# EAGLE board automatrix (EAGLE 9.3.2), part 1 of 3
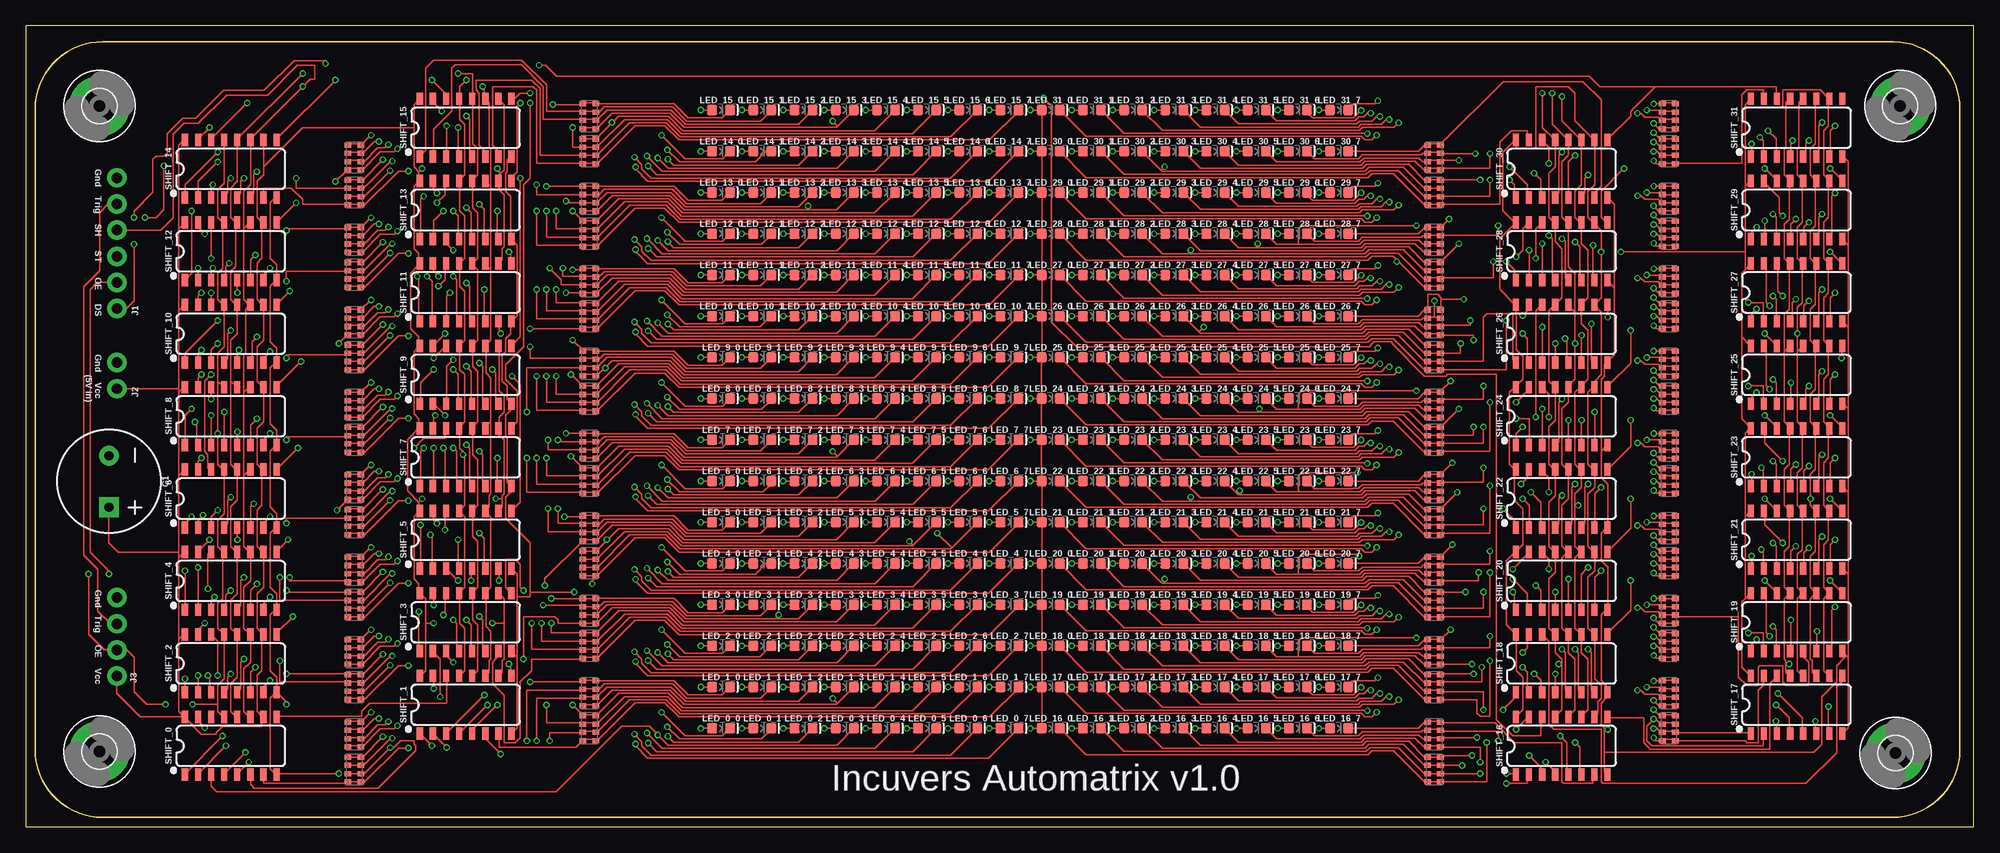
[diagram p5: board, top side]
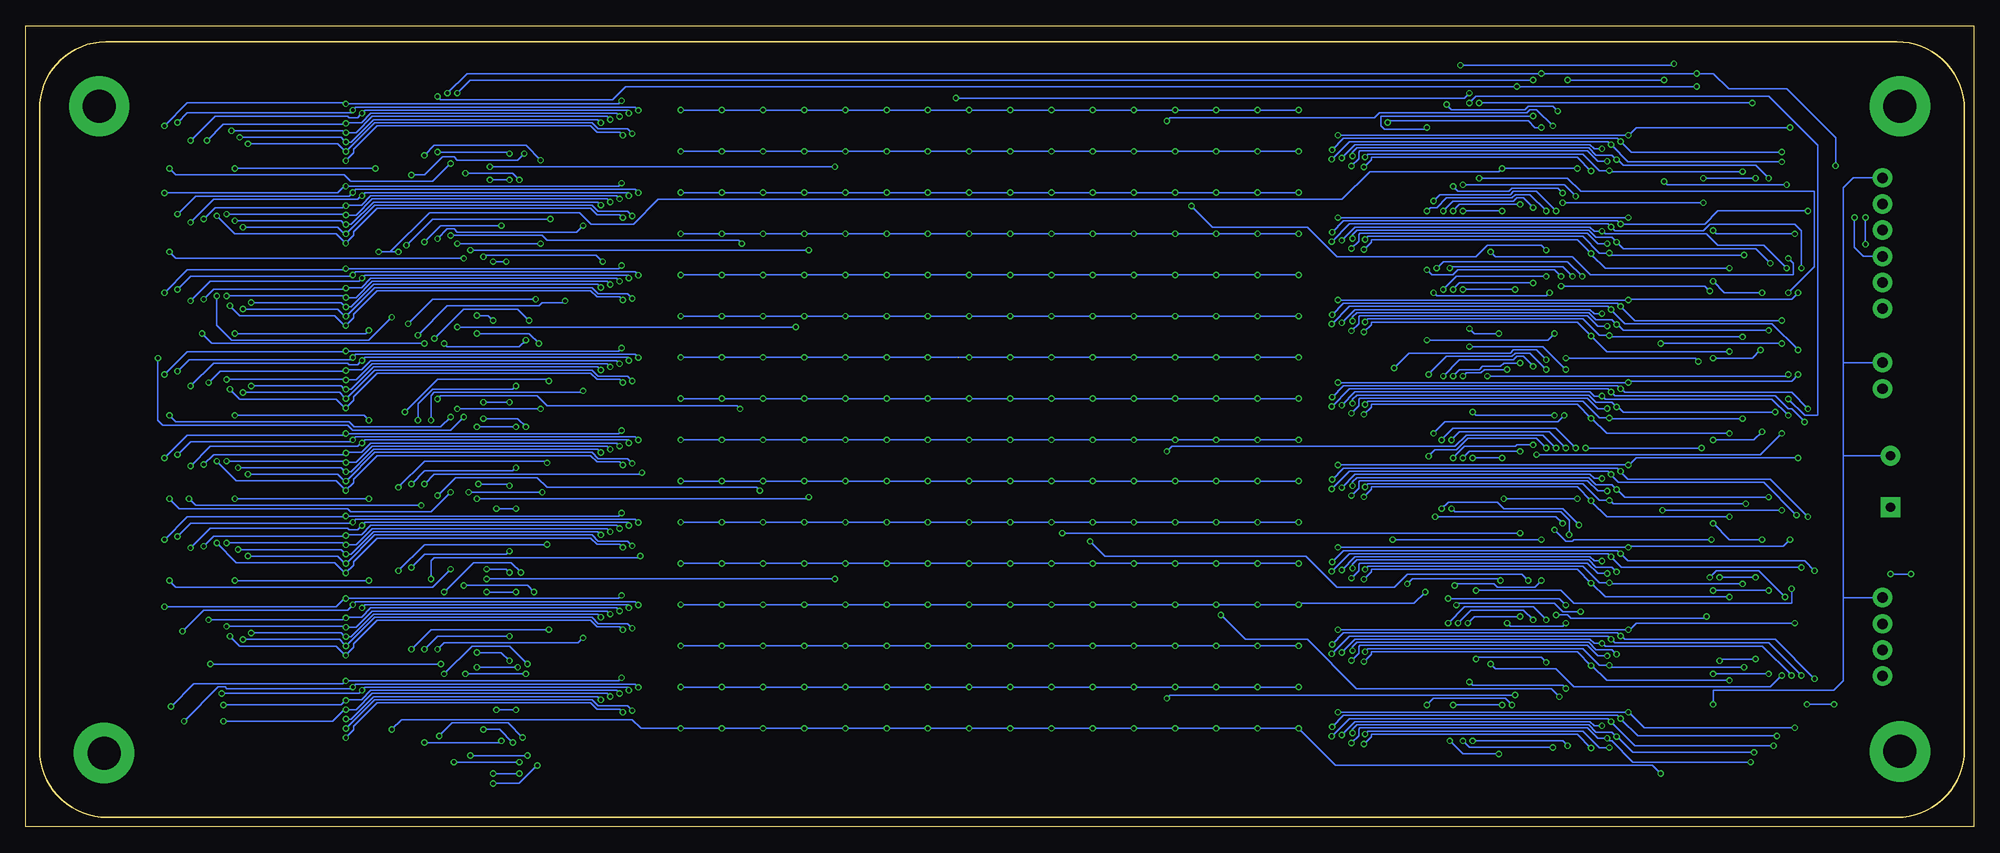
[diagram p6: board, bottom side, seen from below]

Size 189.11 x 77.75 mm. Coordinates in mm from the lower left corner, seen from the top.
Outline: 0,0 189.11,0 189.11,77.75 0,77.75 0,0
Outline: 7.47,76.2 arc90 0.91,69.65 0.91,7.47 arc90 7.47,0.91 181.2,0.91 arc90 187.76,7.47 187.76,69.65 arc90 181.36,76.2 7.47,76.2
Copper layers (1*16): Top 0.035559375mm / dielectric 1.6mm / Bottom 0.035559375mm
Design rules "oshpark-2layer": minimum track width 6mil, minimum drill 10mil, track to track 6mil, track to pad 6mil, pad to pad 6mil, via to via 6mil, smd to smd 6mil, copper to edge 15mil, drill to drill 6mil, minimum pad ring 5mil, minimum via ring 5mil, stop-mask expansion 2.5mil, vias tented up to drill 0mil, thermal gap 10mil
Net classes: 0 default: width 0.152 mm, drill 0.152 mm, clearance 0.152 mm

## Footprints (pad centres in the part's own frame; a part is rotated, then mirrored left to right if it is on the bottom)
0603-ARC = smd 0.5 x 0.65: 1 -1.2,-0.625; 2 -0.4,-0.625; 3 0.4,-0.625; 4 1.2,-0.625; 5 1.2,0.625; 6 0.4,0.625; 7 -0.4,0.625; 8 -1.2,0.625
CPOL-RADIAL-5MM-10MM = drill 0.9 pad 1.93 square: + 2.5,0 | drill 0.9 pad 1.93: - -2.5,0
3,2-PAD = drill 3.2 pad 5.842: B3,2 0,0
1X06_NO_SILK = drill 1.016 pad 1.88: 1 0,0; 2 2.54,0; 3 5.08,0; 4 7.62,0; 5 10.16,0; 6 12.7,0
1X02_NO_SILK = drill 1.016 pad 1.88: 1 0,0; 2 2.54,0
1X04_NO_SILK = drill 1.016 pad 1.88: 1 0,0; 2 2.54,0; 3 5.08,0; 4 7.62,0
LED-0603 = smd 1 x 1: A -0.877,0; C 0.877,0
SO16 = smd 0.6 x 1.2: 1 -4.445,-2.8; 2 -3.175,-2.8; 3 -1.905,-2.8; 4 -0.635,-2.8; 5 0.635,-2.8; 6 1.905,-2.8; 7 3.175,-2.8; 8 4.445,-2.8; 9 4.445,2.8; 10 3.175,2.8; 11 1.905,2.8; 12 0.635,2.8; 13 -0.635,2.8; 14 -1.905,2.8; 15 -3.175,2.8; 16 -4.445,2.8

## Placement (x,y rotation side)
4R_0_0  [0603-ARC]  31.91,8.97 270 top
4R_0_1  [0603-ARC]  31.91,5.57 270 top
4R_1_0  [0603-ARC]  54.71,12.97 270 top
4R_1_1  [0603-ARC]  54.71,9.57 270 top
4R_2_0  [0603-ARC]  31.91,16.97 270 top
4R_2_1  [0603-ARC]  31.91,13.57 270 top
4R_3_0  [0603-ARC]  54.71,20.97 270 top
4R_3_1  [0603-ARC]  54.71,17.57 270 top
4R_4_0  [0603-ARC]  31.91,24.97 270 top
4R_4_1  [0603-ARC]  31.91,21.57 270 top
4R_5_0  [0603-ARC]  54.71,28.97 270 top
4R_5_1  [0603-ARC]  54.71,25.57 270 top
4R_6_0  [0603-ARC]  31.91,32.97 270 top
4R_6_1  [0603-ARC]  31.91,29.57 270 top
4R_7_0  [0603-ARC]  54.71,36.97 270 top
4R_7_1  [0603-ARC]  54.71,33.57 270 top
4R_8_0  [0603-ARC]  31.91,40.97 270 top
4R_8_1  [0603-ARC]  31.91,37.57 270 top
4R_9_0  [0603-ARC]  54.71,44.97 270 top
4R_9_1  [0603-ARC]  54.71,41.57 270 top
4R_10_0  [0603-ARC]  31.91,48.97 270 top
4R_10_1  [0603-ARC]  31.91,45.57 270 top
4R_11_0  [0603-ARC]  54.71,52.97 270 top
4R_11_1  [0603-ARC]  54.71,49.57 270 top
4R_12_0  [0603-ARC]  31.91,56.97 270 top
4R_12_1  [0603-ARC]  31.91,53.57 270 top
4R_13_0  [0603-ARC]  54.71,60.97 270 top
4R_13_1  [0603-ARC]  54.71,57.57 270 top
4R_14_0  [0603-ARC]  31.91,64.97 270 top
4R_14_1  [0603-ARC]  31.91,61.57 270 top
4R_15_0  [0603-ARC]  54.71,68.97 270 top
4R_15_1  [0603-ARC]  54.71,65.57 270 top
4R_16_0  [0603-ARC]  136.71,5.57 90 top
4R_16_1  [0603-ARC]  136.71,8.97 90 top
4R_17_0  [0603-ARC]  159.51,9.57 90 top
4R_17_1  [0603-ARC]  159.51,12.97 90 top
4R_18_0  [0603-ARC]  136.71,13.57 90 top
4R_18_1  [0603-ARC]  136.71,16.97 90 top
4R_19_0  [0603-ARC]  159.51,17.57 90 top
4R_19_1  [0603-ARC]  159.51,20.97 90 top
4R_20_0  [0603-ARC]  136.71,21.57 90 top
4R_20_1  [0603-ARC]  136.71,24.97 90 top
4R_21_0  [0603-ARC]  159.51,25.57 90 top
4R_21_1  [0603-ARC]  159.51,28.97 90 top
4R_22_0  [0603-ARC]  136.71,29.57 90 top
4R_22_1  [0603-ARC]  136.71,32.97 90 top
4R_23_0  [0603-ARC]  159.51,33.57 90 top
4R_23_1  [0603-ARC]  159.51,36.97 90 top
4R_24_0  [0603-ARC]  136.71,37.57 90 top
4R_24_1  [0603-ARC]  136.71,40.97 90 top
4R_25_0  [0603-ARC]  159.51,41.57 90 top
4R_25_1  [0603-ARC]  159.51,44.97 90 top
4R_26_0  [0603-ARC]  136.71,45.57 90 top
4R_26_1  [0603-ARC]  136.71,48.97 90 top
4R_27_0  [0603-ARC]  159.51,49.57 90 top
4R_27_1  [0603-ARC]  159.51,52.97 90 top
4R_28_0  [0603-ARC]  136.71,53.57 90 top
4R_28_1  [0603-ARC]  136.71,56.97 90 top
4R_29_0  [0603-ARC]  159.51,57.57 90 top
4R_29_1  [0603-ARC]  159.51,60.97 90 top
4R_30_0  [0603-ARC]  136.71,61.57 90 top
4R_30_1  [0603-ARC]  136.71,64.97 90 top
4R_31_0  [0603-ARC]  159.51,65.57 90 top
4R_31_1  [0603-ARC]  159.51,68.97 90 top
C1  470 uF  [CPOL-RADIAL-5MM-10MM]  8.08,33.53 270 top
H1  MOUNT-PAD-ROUND3.2  [3,2-PAD]  7.16,69.95 0 top
H2  MOUNT-PAD-ROUND3.2  [3,2-PAD]  181.97,69.95 0 top
H3  MOUNT-PAD-ROUND3.2  [3,2-PAD]  7.16,7.32 0 top
H4  MOUNT-PAD-ROUND3.2  [3,2-PAD]  181.51,7.16 0 top
J1  [1X06_NO_SILK]  8.84,50.29 90 top
J2  [1X02_NO_SILK]  8.84,42.52 90 top
J3  [1X04_NO_SILK]  8.84,14.63 90 top
LED_0_0  GREEN  [LED-0603]  67.51,9.57 0 top
LED_0_1  GREEN  [LED-0603]  71.51,9.57 0 top
LED_0_2  GREEN  [LED-0603]  75.51,9.57 0 top
LED_0_3  GREEN  [LED-0603]  79.51,9.57 0 top
LED_0_4  GREEN  [LED-0603]  83.51,9.57 0 top
LED_0_5  GREEN  [LED-0603]  87.51,9.57 0 top
LED_0_6  GREEN  [LED-0603]  91.51,9.57 0 top
LED_0_7  GREEN  [LED-0603]  95.51,9.57 0 top
LED_1_0  GREEN  [LED-0603]  67.51,13.57 0 top
LED_1_1  GREEN  [LED-0603]  71.51,13.57 0 top
LED_1_2  GREEN  [LED-0603]  75.51,13.57 0 top
LED_1_3  GREEN  [LED-0603]  79.51,13.57 0 top
LED_1_4  GREEN  [LED-0603]  83.51,13.57 0 top
LED_1_5  GREEN  [LED-0603]  87.51,13.57 0 top
LED_1_6  GREEN  [LED-0603]  91.51,13.57 0 top
LED_1_7  GREEN  [LED-0603]  95.51,13.57 0 top
LED_2_0  GREEN  [LED-0603]  67.51,17.57 0 top
LED_2_1  GREEN  [LED-0603]  71.51,17.57 0 top
LED_2_2  GREEN  [LED-0603]  75.51,17.57 0 top
LED_2_3  GREEN  [LED-0603]  79.51,17.57 0 top
LED_2_4  GREEN  [LED-0603]  83.51,17.57 0 top
LED_2_5  GREEN  [LED-0603]  87.51,17.57 0 top
LED_2_6  GREEN  [LED-0603]  91.51,17.57 0 top
LED_2_7  GREEN  [LED-0603]  95.51,17.57 0 top
LED_3_0  GREEN  [LED-0603]  67.51,21.57 0 top
LED_3_1  GREEN  [LED-0603]  71.51,21.57 0 top
LED_3_2  GREEN  [LED-0603]  75.51,21.57 0 top
LED_3_3  GREEN  [LED-0603]  79.51,21.57 0 top
LED_3_4  GREEN  [LED-0603]  83.51,21.57 0 top
LED_3_5  GREEN  [LED-0603]  87.51,21.57 0 top
LED_3_6  GREEN  [LED-0603]  91.51,21.57 0 top
LED_3_7  GREEN  [LED-0603]  95.51,21.57 0 top
LED_4_0  GREEN  [LED-0603]  67.51,25.57 0 top
LED_4_1  GREEN  [LED-0603]  71.51,25.57 0 top
LED_4_2  GREEN  [LED-0603]  75.51,25.57 0 top
LED_4_3  GREEN  [LED-0603]  79.51,25.57 0 top
LED_4_4  GREEN  [LED-0603]  83.51,25.57 0 top
LED_4_5  GREEN  [LED-0603]  87.51,25.57 0 top
LED_4_6  GREEN  [LED-0603]  91.51,25.57 0 top
LED_4_7  GREEN  [LED-0603]  95.51,25.57 0 top
LED_5_0  GREEN  [LED-0603]  67.51,29.57 0 top
LED_5_1  GREEN  [LED-0603]  71.51,29.57 0 top
LED_5_2  GREEN  [LED-0603]  75.51,29.57 0 top
LED_5_3  GREEN  [LED-0603]  79.51,29.57 0 top
LED_5_4  GREEN  [LED-0603]  83.51,29.57 0 top
LED_5_5  GREEN  [LED-0603]  87.51,29.57 0 top
LED_5_6  GREEN  [LED-0603]  91.51,29.57 0 top
LED_5_7  GREEN  [LED-0603]  95.51,29.57 0 top
LED_6_0  GREEN  [LED-0603]  67.51,33.57 0 top
LED_6_1  GREEN  [LED-0603]  71.51,33.57 0 top
LED_6_2  GREEN  [LED-0603]  75.51,33.57 0 top
LED_6_3  GREEN  [LED-0603]  79.51,33.57 0 top
LED_6_4  GREEN  [LED-0603]  83.51,33.57 0 top
LED_6_5  GREEN  [LED-0603]  87.51,33.57 0 top
LED_6_6  GREEN  [LED-0603]  91.51,33.57 0 top
LED_6_7  GREEN  [LED-0603]  95.51,33.57 0 top
LED_7_0  GREEN  [LED-0603]  67.51,37.57 0 top
LED_7_1  GREEN  [LED-0603]  71.51,37.57 0 top
LED_7_2  GREEN  [LED-0603]  75.51,37.57 0 top
LED_7_3  GREEN  [LED-0603]  79.51,37.57 0 top
LED_7_4  GREEN  [LED-0603]  83.51,37.57 0 top
LED_7_5  GREEN  [LED-0603]  87.51,37.57 0 top
LED_7_6  GREEN  [LED-0603]  91.51,37.57 0 top
LED_7_7  GREEN  [LED-0603]  95.51,37.57 0 top
LED_8_0  GREEN  [LED-0603]  67.51,41.57 0 top
LED_8_1  GREEN  [LED-0603]  71.51,41.57 0 top
LED_8_2  GREEN  [LED-0603]  75.51,41.57 0 top
LED_8_3  GREEN  [LED-0603]  79.51,41.57 0 top
LED_8_4  GREEN  [LED-0603]  83.51,41.57 0 top
LED_8_5  GREEN  [LED-0603]  87.51,41.57 0 top
LED_8_6  GREEN  [LED-0603]  91.51,41.57 0 top
LED_8_7  GREEN  [LED-0603]  95.51,41.57 0 top
LED_9_0  GREEN  [LED-0603]  67.51,45.57 0 top
LED_9_1  GREEN  [LED-0603]  71.51,45.57 0 top
LED_9_2  GREEN  [LED-0603]  75.51,45.57 0 top
LED_9_3  GREEN  [LED-0603]  79.51,45.57 0 top
LED_9_4  GREEN  [LED-0603]  83.51,45.57 0 top
LED_9_5  GREEN  [LED-0603]  87.51,45.57 0 top
LED_9_6  GREEN  [LED-0603]  91.51,45.57 0 top
LED_9_7  GREEN  [LED-0603]  95.51,45.57 0 top
LED_10_0  GREEN  [LED-0603]  67.51,49.57 0 top
LED_10_1  GREEN  [LED-0603]  71.51,49.57 0 top
LED_10_2  GREEN  [LED-0603]  75.51,49.57 0 top
LED_10_3  GREEN  [LED-0603]  79.51,49.57 0 top
LED_10_4  GREEN  [LED-0603]  83.51,49.57 0 top
LED_10_5  GREEN  [LED-0603]  87.51,49.57 0 top
LED_10_6  GREEN  [LED-0603]  91.51,49.57 0 top
LED_10_7  GREEN  [LED-0603]  95.51,49.57 0 top
LED_11_0  GREEN  [LED-0603]  67.51,53.57 0 top
LED_11_1  GREEN  [LED-0603]  71.51,53.57 0 top
LED_11_2  GREEN  [LED-0603]  75.51,53.57 0 top
LED_11_3  GREEN  [LED-0603]  79.51,53.57 0 top
LED_11_4  GREEN  [LED-0603]  83.51,53.57 0 top
LED_11_5  GREEN  [LED-0603]  87.51,53.57 0 top
LED_11_6  GREEN  [LED-0603]  91.51,53.57 0 top
LED_11_7  GREEN  [LED-0603]  95.51,53.57 0 top
LED_12_0  GREEN  [LED-0603]  67.51,57.57 0 top
LED_12_1  GREEN  [LED-0603]  71.51,57.57 0 top
LED_12_2  GREEN  [LED-0603]  75.51,57.57 0 top
LED_12_3  GREEN  [LED-0603]  79.51,57.57 0 top
LED_12_4  GREEN  [LED-0603]  83.51,57.57 0 top
LED_12_5  GREEN  [LED-0603]  87.51,57.57 0 top
LED_12_6  GREEN  [LED-0603]  91.51,57.57 0 top
LED_12_7  GREEN  [LED-0603]  95.51,57.57 0 top
LED_13_0  GREEN  [LED-0603]  67.51,61.57 0 top
LED_13_1  GREEN  [LED-0603]  71.51,61.57 0 top
LED_13_2  GREEN  [LED-0603]  75.51,61.57 0 top
LED_13_3  GREEN  [LED-0603]  79.51,61.57 0 top
LED_13_4  GREEN  [LED-0603]  83.51,61.57 0 top
LED_13_5  GREEN  [LED-0603]  87.51,61.57 0 top
LED_13_6  GREEN  [LED-0603]  91.51,61.57 0 top
LED_13_7  GREEN  [LED-0603]  95.51,61.57 0 top
LED_14_0  GREEN  [LED-0603]  67.51,65.57 0 top
LED_14_1  GREEN  [LED-0603]  71.51,65.57 0 top
LED_14_2  GREEN  [LED-0603]  75.51,65.57 0 top
LED_14_3  GREEN  [LED-0603]  79.51,65.57 0 top
LED_14_4  GREEN  [LED-0603]  83.51,65.57 0 top
LED_14_5  GREEN  [LED-0603]  87.51,65.57 0 top
LED_14_6  GREEN  [LED-0603]  91.51,65.57 0 top
LED_14_7  GREEN  [LED-0603]  95.51,65.57 0 top
LED_15_0  GREEN  [LED-0603]  67.51,69.57 0 top
LED_15_1  GREEN  [LED-0603]  71.51,69.57 0 top
LED_15_2  GREEN  [LED-0603]  75.51,69.57 0 top
LED_15_3  GREEN  [LED-0603]  79.51,69.57 0 top
LED_15_4  GREEN  [LED-0603]  83.51,69.57 0 top
LED_15_5  GREEN  [LED-0603]  87.51,69.57 0 top
LED_15_6  GREEN  [LED-0603]  91.51,69.57 0 top
LED_15_7  GREEN  [LED-0603]  95.51,69.57 0 top
LED_16_0  GREEN  [LED-0603]  99.51,9.57 0 top
LED_16_1  GREEN  [LED-0603]  103.51,9.57 0 top
LED_16_2  GREEN  [LED-0603]  107.51,9.57 0 top
LED_16_3  GREEN  [LED-0603]  111.51,9.57 0 top
LED_16_4  GREEN  [LED-0603]  115.51,9.57 0 top
LED_16_5  GREEN  [LED-0603]  119.51,9.57 0 top
LED_16_6  GREEN  [LED-0603]  123.51,9.57 0 top
LED_16_7  GREEN  [LED-0603]  127.51,9.57 0 top
LED_17_0  GREEN  [LED-0603]  99.51,13.57 0 top
LED_17_1  GREEN  [LED-0603]  103.51,13.57 0 top
LED_17_2  GREEN  [LED-0603]  107.51,13.57 0 top
LED_17_3  GREEN  [LED-0603]  111.51,13.57 0 top
LED_17_4  GREEN  [LED-0603]  115.51,13.57 0 top
LED_17_5  GREEN  [LED-0603]  119.51,13.57 0 top
LED_17_6  GREEN  [LED-0603]  123.51,13.57 0 top
LED_17_7  GREEN  [LED-0603]  127.51,13.57 0 top
LED_18_0  GREEN  [LED-0603]  99.51,17.57 0 top
LED_18_1  GREEN  [LED-0603]  103.51,17.57 0 top
LED_18_2  GREEN  [LED-0603]  107.51,17.57 0 top
LED_18_3  GREEN  [LED-0603]  111.51,17.57 0 top
LED_18_4  GREEN  [LED-0603]  115.51,17.57 0 top
LED_18_5  GREEN  [LED-0603]  119.51,17.57 0 top
LED_18_6  GREEN  [LED-0603]  123.51,17.57 0 top
LED_18_7  GREEN  [LED-0603]  127.51,17.57 0 top
LED_19_0  GREEN  [LED-0603]  99.51,21.57 0 top
LED_19_1  GREEN  [LED-0603]  103.51,21.57 0 top
LED_19_2  GREEN  [LED-0603]  107.51,21.57 0 top
LED_19_3  GREEN  [LED-0603]  111.51,21.57 0 top
LED_19_4  GREEN  [LED-0603]  115.51,21.57 0 top
LED_19_5  GREEN  [LED-0603]  119.51,21.57 0 top
LED_19_6  GREEN  [LED-0603]  123.51,21.57 0 top
LED_19_7  GREEN  [LED-0603]  127.51,21.57 0 top
LED_20_0  GREEN  [LED-0603]  99.51,25.57 0 top
LED_20_1  GREEN  [LED-0603]  103.51,25.57 0 top
LED_20_2  GREEN  [LED-0603]  107.51,25.57 0 top
LED_20_3  GREEN  [LED-0603]  111.51,25.57 0 top
LED_20_4  GREEN  [LED-0603]  115.51,25.57 0 top
LED_20_5  GREEN  [LED-0603]  119.51,25.57 0 top
LED_20_6  GREEN  [LED-0603]  123.51,25.57 0 top
LED_20_7  GREEN  [LED-0603]  127.51,25.57 0 top
LED_21_0  GREEN  [LED-0603]  99.51,29.57 0 top
LED_21_1  GREEN  [LED-0603]  103.51,29.57 0 top
LED_21_2  GREEN  [LED-0603]  107.51,29.57 0 top
LED_21_3  GREEN  [LED-0603]  111.51,29.57 0 top
LED_21_4  GREEN  [LED-0603]  115.51,29.57 0 top
LED_21_5  GREEN  [LED-0603]  119.51,29.57 0 top
LED_21_6  GREEN  [LED-0603]  123.51,29.57 0 top
LED_21_7  GREEN  [LED-0603]  127.51,29.57 0 top
LED_22_0  GREEN  [LED-0603]  99.51,33.57 0 top
LED_22_1  GREEN  [LED-0603]  103.51,33.57 0 top
LED_22_2  GREEN  [LED-0603]  107.51,33.57 0 top
LED_22_3  GREEN  [LED-0603]  111.51,33.57 0 top
LED_22_4  GREEN  [LED-0603]  115.51,33.57 0 top
LED_22_5  GREEN  [LED-0603]  119.51,33.57 0 top
LED_22_6  GREEN  [LED-0603]  123.51,33.57 0 top
LED_22_7  GREEN  [LED-0603]  127.51,33.57 0 top
LED_23_0  GREEN  [LED-0603]  99.51,37.57 0 top
LED_23_1  GREEN  [LED-0603]  103.51,37.57 0 top
LED_23_2  GREEN  [LED-0603]  107.51,37.57 0 top
LED_23_3  GREEN  [LED-0603]  111.51,37.57 0 top
LED_23_4  GREEN  [LED-0603]  115.51,37.57 0 top
LED_23_5  GREEN  [LED-0603]  119.51,37.57 0 top
LED_23_6  GREEN  [LED-0603]  123.51,37.57 0 top
LED_23_7  GREEN  [LED-0603]  127.51,37.57 0 top
LED_24_0  GREEN  [LED-0603]  99.51,41.57 0 top
LED_24_1  GREEN  [LED-0603]  103.51,41.57 0 top
LED_24_2  GREEN  [LED-0603]  107.51,41.57 0 top
LED_24_3  GREEN  [LED-0603]  111.51,41.57 0 top
LED_24_4  GREEN  [LED-0603]  115.51,41.57 0 top
LED_24_5  GREEN  [LED-0603]  119.51,41.57 0 top
LED_24_6  GREEN  [LED-0603]  123.51,41.57 0 top
LED_24_7  GREEN  [LED-0603]  127.51,41.57 0 top
LED_25_0  GREEN  [LED-0603]  99.51,45.57 0 top
LED_25_1  GREEN  [LED-0603]  103.51,45.57 0 top
LED_25_2  GREEN  [LED-0603]  107.51,45.57 0 top
LED_25_3  GREEN  [LED-0603]  111.51,45.57 0 top
LED_25_4  GREEN  [LED-0603]  115.51,45.57 0 top
LED_25_5  GREEN  [LED-0603]  119.51,45.57 0 top
LED_25_6  GREEN  [LED-0603]  123.51,45.57 0 top
LED_25_7  GREEN  [LED-0603]  127.51,45.57 0 top
LED_26_0  GREEN  [LED-0603]  99.51,49.57 0 top
LED_26_1  GREEN  [LED-0603]  103.51,49.57 0 top
LED_26_2  GREEN  [LED-0603]  107.51,49.57 0 top
LED_26_3  GREEN  [LED-0603]  111.51,49.57 0 top
LED_26_4  GREEN  [LED-0603]  115.51,49.57 0 top
LED_26_5  GREEN  [LED-0603]  119.51,49.57 0 top
LED_26_6  GREEN  [LED-0603]  123.51,49.57 0 top
LED_26_7  GREEN  [LED-0603]  127.51,49.57 0 top
LED_27_0  GREEN  [LED-0603]  99.51,53.57 0 top
LED_27_1  GREEN  [LED-0603]  103.51,53.57 0 top
LED_27_2  GREEN  [LED-0603]  107.51,53.57 0 top
LED_27_3  GREEN  [LED-0603]  111.51,53.57 0 top
LED_27_4  GREEN  [LED-0603]  115.51,53.57 0 top
LED_27_5  GREEN  [LED-0603]  119.51,53.57 0 top
LED_27_6  GREEN  [LED-0603]  123.51,53.57 0 top
LED_27_7  GREEN  [LED-0603]  127.51,53.57 0 top
LED_28_0  GREEN  [LED-0603]  99.51,57.57 0 top
LED_28_1  GREEN  [LED-0603]  103.51,57.57 0 top
LED_28_2  GREEN  [LED-0603]  107.51,57.57 0 top
LED_28_3  GREEN  [LED-0603]  111.51,57.57 0 top
LED_28_4  GREEN  [LED-0603]  115.51,57.57 0 top
LED_28_5  GREEN  [LED-0603]  119.51,57.57 0 top
LED_28_6  GREEN  [LED-0603]  123.51,57.57 0 top
LED_28_7  GREEN  [LED-0603]  127.51,57.57 0 top
LED_29_0  GREEN  [LED-0603]  99.51,61.57 0 top
LED_29_1  GREEN  [LED-0603]  103.51,61.57 0 top
LED_29_2  GREEN  [LED-0603]  107.51,61.57 0 top
LED_29_3  GREEN  [LED-0603]  111.51,61.57 0 top
LED_29_4  GREEN  [LED-0603]  115.51,61.57 0 top
LED_29_5  GREEN  [LED-0603]  119.51,61.57 0 top
LED_29_6  GREEN  [LED-0603]  123.51,61.57 0 top
LED_29_7  GREEN  [LED-0603]  127.51,61.57 0 top
LED_30_0  GREEN  [LED-0603]  99.51,65.57 0 top
LED_30_1  GREEN  [LED-0603]  103.51,65.57 0 top
LED_30_2  GREEN  [LED-0603]  107.51,65.57 0 top
LED_30_3  GREEN  [LED-0603]  111.51,65.57 0 top
LED_30_4  GREEN  [LED-0603]  115.51,65.57 0 top
LED_30_5  GREEN  [LED-0603]  119.51,65.57 0 top
LED_30_6  GREEN  [LED-0603]  123.51,65.57 0 top
LED_30_7  GREEN  [LED-0603]  127.51,65.57 0 top
LED_31_0  GREEN  [LED-0603]  99.51,69.57 0 top
LED_31_1  GREEN  [LED-0603]  103.51,69.57 0 top
LED_31_2  GREEN  [LED-0603]  107.51,69.57 0 top
LED_31_3  GREEN  [LED-0603]  111.51,69.57 0 top
LED_31_4  GREEN  [LED-0603]  115.51,69.57 0 top
LED_31_5  GREEN  [LED-0603]  119.51,69.57 0 top
LED_31_6  GREEN  [LED-0603]  123.51,69.57 0 top
LED_31_7  GREEN  [LED-0603]  127.51,69.57 0 top
SHIFT_0  SN74HC595D  [SO16]  19.91,7.87 0 top
SHIFT_1  SN74HC595D  [SO16]  42.71,11.87 0 top
SHIFT_2  SN74HC595D  [SO16]  19.91,15.87 0 top
SHIFT_3  SN74HC595D  [SO16]  42.71,19.87 0 top
SHIFT_4  SN74HC595D  [SO16]  19.91,23.87 0 top
SHIFT_5  SN74HC595D  [SO16]  42.71,27.87 0 top
SHIFT_6  SN74HC595D  [SO16]  19.91,31.87 0 top
SHIFT_7  SN74HC595D  [SO16]  42.71,35.87 0 top
SHIFT_8  SN74HC595D  [SO16]  19.91,39.87 0 top
SHIFT_9  SN74HC595D  [SO16]  42.71,43.87 0 top
SHIFT_10  SN74HC595D  [SO16]  19.91,47.87 0 top
SHIFT_11  SN74HC595D  [SO16]  42.71,51.87 0 top
SHIFT_12  SN74HC595D  [SO16]  19.91,55.87 0 top
SHIFT_13  SN74HC595D  [SO16]  42.71,59.87 0 top
SHIFT_14  SN74HC595D  [SO16]  19.91,63.87 0 top
SHIFT_15  SN74HC595D  [SO16]  42.71,67.87 0 top
SHIFT_16  SN74HC595D  [SO16]  149.11,7.87 0 top
SHIFT_17  SN74HC595D  [SO16]  171.91,11.87 0 top
SHIFT_18  SN74HC595D  [SO16]  149.11,15.87 0 top
SHIFT_19  SN74HC595D  [SO16]  171.91,19.87 0 top
SHIFT_20  SN74HC595D  [SO16]  149.11,23.87 0 top
SHIFT_21  SN74HC595D  [SO16]  171.91,27.87 0 top
SHIFT_22  SN74HC595D  [SO16]  149.11,31.87 0 top
SHIFT_23  SN74HC595D  [SO16]  171.91,35.87 0 top
SHIFT_24  SN74HC595D  [SO16]  149.11,39.87 0 top
SHIFT_25  SN74HC595D  [SO16]  171.91,43.87 0 top
SHIFT_26  SN74HC595D  [SO16]  149.11,47.87 0 top
SHIFT_27  SN74HC595D  [SO16]  171.91,51.87 0 top
SHIFT_28  SN74HC595D  [SO16]  149.11,55.87 0 top
SHIFT_29  SN74HC595D  [SO16]  171.91,59.87 0 top
SHIFT_30  SN74HC595D  [SO16]  149.11,63.87 0 top
SHIFT_31  SN74HC595D  [SO16]  171.91,67.87 0 top

## Tracks (layer width: path | path; a pad name or v marks a point on that pad's centre or on a via)
CLK  (via drill 0.35)
  Top 0.152: SHIFT_16.11 151.03,10.73 151.67,11.36 151.67,16.28 151.03,16.92 151.03,18.66 SHIFT_18.11 150.88,18.82 150.4,19.3 150.4,26.12 150.88,26.6 SHIFT_20.11 150.88,26.76 150.4,27.24 150.4,31.2 | 150.4,31.2 150.4,32.32 151.03,32.95 151.03,34.54 SHIFT_22.11 150.88,34.7 150.4,35.17 150.4,42.16 150.88,42.63 SHIFT_24.11 151.03,42.79 151.67,43.43 151.67,48.19 151.03,48.83 151.03,50.57 SHIFT_26.11 151.03,50.73 151.67,51.37 151.67,55.97 151.03,56.6 151.03,58.51 SHIFT_28.11 150.88,58.67 150.4,59.14 150.4,61.68 151.03,62.32 151.03,66.61 SHIFT_30.11 150.88,66.76 149.13,68.51 v149.13,70.89 | SHIFT_17.11 173.74,14.69 173.42,15.01 173.42,16.12 173.26,16.28 173.26,22.16 173.74,22.63 SHIFT_19.11 173.74,22.79 173.26,23.27 173.26,26.28 173.74,26.76 173.74,30.57 SHIFT_21.11 173.74,30.73 173.26,31.2 v173.26,31.84 173.26,34.22 173.74,34.7 173.74,38.67 SHIFT_23.11 173.74,38.82 173.26,39.3 173.26,42 173.74,42.48 173.74,46.6 SHIFT_25.11 173.74,46.76 173.26,47.24 173.26,50.25 173.74,50.73 173.74,54.54 SHIFT_27.11 173.74,54.7 173.26,55.18 173.26,57.87 173.74,58.35 173.74,62.64 SHIFT_29.11 173.74,62.8 173.26,63.27 173.26,65.81 173.74,66.29 173.74,70.57 SHIFT_31.11 | v150.72,31.2 150.4,31.2 | 21.18,58.03 21.18,51.21 21.65,50.73 SHIFT_10.11 21.65,50.57 21.34,50.25 21.34,45.97 21.18,45.81 21.18,42.16 | SHIFT_12.11 21.18,58.03 | 21.18,58.03 21.18,61.68 21.81,62.32 21.81,66.61 SHIFT_14.11 21.81,66.76 v26.89,71.84 27.59,72.54 28.04,72.54 28.04,73.91 26.37,73.91 23.47,71.02 19.51,71.02 16.76,68.28 15.39,68.28 14.33,67.21 14.33,59.13 13.11,57.91 J1.4
  Top 0.152: SHIFT_0.11 21.65,10.73 21.18,11.2 21.18,15.33 21.81,15.96 SHIFT_2.11 21.65,18.82 21.18,19.3 21.18,23.27 21.81,23.9 21.81,26.6 SHIFT_4.11 21.65,26.76 21.18,27.24 21.18,34.06 | 21.18,34.06 21.65,34.54 SHIFT_6.11 | 21.18,42.16 21.65,42.63 SHIFT_8.11 | 21.18,34.06 21.18,42.16 | SHIFT_1.11 44.67,14.69 44.99,15.01 44.99,16.12 45.15,16.28 45.15,18.98 44.67,19.46 44.67,22.63 SHIFT_3.11 44.67,22.79 45.15,23.27 45.15,30.09 44.67,30.57 SHIFT_5.11 44.99,31.05 44.99,32.16 45.15,32.32 45.15,39.3 | 45.15,39.3 44.67,38.82 SHIFT_7.11 | 45.15,39.3 45.15,43.59 44.67,44.06 44.67,46.6 SHIFT_9.11 44.67,46.76 45.15,47.24 45.15,54.06 | 45.15,54.06 44.67,54.54 SHIFT_11.11 | 45.15,62.16 44.67,62.64 SHIFT_13.11 | 45.15,54.06 45.15,62.16 | 45.15,62.16 45.15,65.81 44.99,65.97 44.99,70.26 44.67,70.57 SHIFT_15.11 44.51,70.73 44.51,71.69 v44.35,71.84
  Bottom 0.152: v150.72,31.2 172.62,31.2 v173.26,31.84 | v26.89,71.84 v44.35,71.84 130.87,71.84 132.14,70.57 148.81,70.57 v149.13,70.89
GND  (via drill 0.35)  (1 unrouted)
  Top 0.152: LED_0_0.A v65.53,9.57 v65.53,9.56 | LED_0_1.A v69.53,9.57 v69.53,9.56 | LED_0_2.A v73.53,9.57 v73.53,9.56 | LED_0_3.A v77.54,9.57 v77.53,9.56 | LED_0_4.A v81.54,9.57 v81.53,9.56 | LED_0_5.A v85.54,9.57 v85.53,9.56 | LED_0_6.A v89.54,9.57 v89.53,9.56 | LED_0_7.A v93.54,9.57 v93.53,9.56 | v97.53,9.56 v97.54,9.57 LED_16_0.A 98.65,9.61 98.65,13.42 LED_17_0.A | LED_16_1.A v101.54,9.57 v101.53,9.56 | LED_16_2.A v105.54,9.57 v105.53,9.56 | LED_16_3.A v109.54,9.57 v109.53,9.56 | LED_16_4.A v113.54,9.57 v113.53,9.56 | LED_16_5.A v117.54,9.57 v117.53,9.56 | LED_16_6.A v121.54,9.57 v121.53,9.56 | LED_16_7.A v125.54,9.57 v125.53,9.56 | LED_1_0.A v65.53,13.57 v65.53,13.56 | LED_1_1.A v69.53,13.57 v69.53,13.56 | LED_1_2.A v73.53,13.57 v73.53,13.56 | LED_1_3.A v77.54,13.57 v77.53,13.56 | LED_1_4.A v81.54,13.57 v81.53,13.56 | LED_1_5.A v85.54,13.57 v85.53,13.56 | LED_1_6.A v89.54,13.57 v89.53,13.56 | LED_1_7.A v93.54,13.57 v93.53,13.56 | LED_17_0.A v97.54,13.57 v97.53,13.56 | LED_17_1.A v101.54,13.57 v101.53,13.56 | LED_17_2.A v105.54,13.57 v105.53,13.56 | LED_17_3.A v109.54,13.57 v109.53,13.56 | LED_17_4.A v113.54,13.57 v113.53,13.56 | LED_17_5.A v117.54,13.57 v117.53,13.56 | LED_17_6.A v121.54,13.57 v121.53,13.56 | LED_17_7.A v125.54,13.57 v125.53,13.56 | LED_2_0.A v65.53,17.57 v65.53,17.56 | LED_2_1.A v69.53,17.57 v69.53,17.56 | LED_2_2.A v73.53,17.57 v73.53,17.56 | LED_2_3.A v77.54,17.57 v77.53,17.56 | LED_2_4.A v81.54,17.57 v81.53,17.56 | LED_2_5.A v85.54,17.57 v85.53,17.56 | LED_2_6.A v89.54,17.57 v89.53,17.56 | LED_2_7.A v93.54,17.57 v93.53,17.56 | LED_18_0.A v97.54,17.57 v97.53,17.56 | LED_18_1.A v101.54,17.57 v101.53,17.56
  Top 0.152: LED_18_2.A v105.54,17.57 v105.53,17.56 | LED_18_3.A v109.54,17.57 v109.53,17.56 | LED_18_4.A v113.54,17.57 v113.53,17.56 | LED_18_5.A v117.54,17.57 v117.53,17.56 | LED_18_6.A v121.54,17.57 v121.53,17.56 | LED_18_7.A v125.54,17.57 v125.53,17.56 | LED_3_0.A v65.53,21.57 v65.53,21.56 | LED_3_1.A v69.53,21.57 v69.53,21.56 | LED_3_2.A v73.53,21.57 v73.53,21.56 | LED_3_3.A v77.54,21.57 v77.53,21.56 | LED_3_4.A v81.54,21.57 v81.53,21.56 | LED_3_5.A v85.54,21.57 v85.53,21.56 | LED_3_6.A v89.54,21.57 v89.53,21.56 | LED_3_7.A v93.54,21.57 v93.53,21.56 | LED_19_0.A v97.54,21.57 v97.53,21.56 | LED_19_1.A v101.54,21.57 v101.53,21.56 | LED_19_2.A v105.54,21.57 v105.53,21.56 | LED_19_3.A v109.54,21.57 v109.53,21.56 | LED_19_4.A v113.54,21.57 v113.53,21.56 | LED_19_5.A v117.54,21.57 v117.53,21.56 | LED_19_6.A v121.54,21.57 v121.53,21.56 | LED_19_7.A v125.54,21.57 v125.53,21.56 | LED_4_0.A v65.53,25.57 v65.53,25.56 | LED_4_1.A v69.53,25.57 v69.53,25.56 | LED_4_2.A v73.53,25.57 v73.53,25.56 | LED_4_3.A v77.54,25.57 v77.53,25.56 | LED_4_4.A v81.54,25.57 v81.53,25.56 | LED_4_5.A v85.54,25.57 v85.53,25.56 | LED_4_6.A v89.54,25.57 v89.53,25.56 | LED_4_7.A v93.54,25.57 v93.53,25.56 | LED_20_0.A v97.54,25.57 v97.53,25.56 | LED_20_1.A v101.54,25.57 v101.53,25.56 | LED_20_2.A v105.54,25.57 v105.53,25.56 | LED_20_3.A v109.54,25.57 v109.53,25.56 | LED_20_4.A v113.54,25.57 v113.53,25.56 | LED_20_5.A v117.54,25.57 v117.53,25.56 | LED_20_6.A v121.54,25.57 v121.53,25.56 | LED_20_7.A v125.54,25.57 v125.53,25.56 | LED_5_0.A v65.53,29.57 v65.53,29.56 | LED_5_1.A v69.53,29.57 v69.53,29.56 | LED_5_2.A v73.53,29.57 v73.53,29.56 | LED_5_3.A v77.54,29.57 v77.53,29.56
  Top 0.152: LED_5_4.A v81.54,29.57 v81.53,29.56 | LED_5_5.A v85.54,29.57 v85.53,29.56 | LED_5_6.A v89.54,29.57 v89.53,29.56 | LED_5_7.A v93.54,29.57 v93.53,29.56 | LED_21_0.A v97.54,29.57 v97.53,29.56 | LED_21_1.A v101.54,29.57 v101.53,29.56 | LED_21_2.A v105.54,29.57 v105.53,29.56 | LED_21_3.A v109.54,29.57 v109.53,29.56 | LED_21_4.A v113.54,29.57 v113.53,29.56 | LED_21_5.A v117.54,29.57 v117.53,29.56 | LED_21_6.A v121.54,29.57 v121.53,29.56 | LED_21_7.A v125.54,29.57 v125.53,29.56 | LED_6_0.A v65.53,33.57 v65.53,33.56 | LED_6_1.A v69.53,33.57 v69.53,33.56 | LED_6_2.A v73.53,33.57 v73.53,33.56 | LED_6_3.A v77.54,33.57 v77.53,33.56 | LED_6_4.A v81.54,33.57 v81.53,33.56 | LED_6_5.A v85.54,33.57 v85.53,33.56 | LED_6_6.A v89.54,33.57 v89.53,33.56 | LED_6_7.A v93.54,33.57 v93.53,33.56 | LED_22_0.A v97.54,33.57 v97.53,33.56 | LED_22_1.A v101.54,33.57 v101.53,33.56 | LED_22_2.A v105.54,33.57 v105.53,33.56 | LED_22_3.A v109.54,33.57 v109.53,33.56 | LED_22_4.A v113.54,33.57 v113.53,33.56 | LED_22_5.A v117.54,33.57 v117.53,33.56 | LED_22_6.A v121.54,33.57 v121.53,33.56 | LED_22_7.A v125.54,33.57 v125.53,33.56 | LED_7_0.A v65.53,37.57 v65.53,37.56 | LED_7_1.A v69.53,37.57 v69.53,37.56 | LED_7_2.A v73.53,37.57 v73.53,37.56 | LED_7_3.A v77.54,37.57 v77.53,37.56 | LED_7_4.A v81.54,37.57 v81.53,37.56 | LED_7_5.A v85.54,37.57 v85.53,37.56 | LED_7_6.A v89.54,37.57 v89.53,37.56 | LED_7_7.A v93.54,37.57 v93.53,37.56 | LED_23_0.A v97.54,37.57 v97.53,37.56 | LED_23_1.A v101.54,37.57 v101.53,37.56 | LED_23_2.A v105.54,37.57 v105.53,37.56 | LED_23_3.A v109.54,37.57 v109.53,37.56 | LED_23_4.A v113.54,37.57 v113.53,37.56 | LED_23_5.A v117.54,37.57 v117.53,37.56
  Top 0.152: LED_23_6.A v121.54,37.57 v121.53,37.56 | LED_23_7.A v125.54,37.57 v125.53,37.56 | LED_8_0.A v65.53,41.57 v65.53,41.56 | LED_8_1.A v69.53,41.57 v69.53,41.56 | LED_8_2.A v73.53,41.57 v73.53,41.56 | LED_8_3.A v77.54,41.57 v77.53,41.56 | LED_8_4.A v81.54,41.57 v81.53,41.56 | LED_8_5.A v85.54,41.57 v85.53,41.56 | LED_8_6.A v89.54,41.57 v89.53,41.56 | LED_8_7.A v93.54,41.57 v93.53,41.56 | LED_24_0.A v97.54,41.57 v97.53,41.56 | LED_24_1.A v101.54,41.57 v101.53,41.56 | LED_24_2.A v105.54,41.57 v105.53,41.56 | LED_24_3.A v109.54,41.57 v109.53,41.56 | LED_24_4.A v113.54,41.57 v113.53,41.56 | LED_24_5.A v117.54,41.57 v117.53,41.56 | LED_24_6.A v121.54,41.57 v121.53,41.56 | LED_24_7.A v125.54,41.57 v125.53,41.56 | LED_9_0.A v65.53,45.57 v65.53,45.56 | LED_9_1.A v69.53,45.57 v69.53,45.56 | LED_9_2.A v73.53,45.57 v73.53,45.56 | LED_9_3.A v77.54,45.57 v77.53,45.56 | LED_9_4.A v81.54,45.57 v81.53,45.56 | LED_9_5.A v85.54,45.57 v85.53,45.56 | LED_9_6.A v89.54,45.57 v89.53,45.56 | LED_9_7.A v93.54,45.57 v93.53,45.56 | LED_25_1.A v101.54,45.57 v101.53,45.56 | LED_25_2.A v105.54,45.57 v105.53,45.56 | LED_25_3.A v109.54,45.57 v109.53,45.56 | LED_25_4.A v113.54,45.57 v113.53,45.56 | LED_25_5.A v117.54,45.57 v117.53,45.56 | LED_25_6.A v121.54,45.57 v121.53,45.56 | LED_25_7.A v125.54,45.57 v125.53,45.56 | LED_10_0.A v65.53,49.57 v65.53,49.56 | LED_10_1.A v69.53,49.57 v69.53,49.56 | LED_10_2.A v73.53,49.57 v73.53,49.56 | LED_10_3.A v77.54,49.57 v77.53,49.56 | LED_10_4.A v81.54,49.57 v81.53,49.56 | LED_10_5.A v85.54,49.57 v85.53,49.56 | LED_10_6.A v89.54,49.57 v89.53,49.56 | LED_10_7.A v93.54,49.57 v93.53,49.56 | LED_26_0.A v97.54,49.57 v97.53,49.56
  Top 0.152: LED_26_1.A v101.54,49.57 v101.53,49.56 | LED_26_2.A v105.54,49.57 v105.53,49.56 | LED_26_3.A v109.54,49.57 v109.53,49.56 | LED_26_4.A v113.54,49.57 v113.53,49.56 | LED_26_5.A v117.54,49.57 v117.53,49.56 | LED_26_6.A v121.54,49.57 v121.53,49.56 | LED_26_7.A v125.54,49.57 v125.53,49.56 | LED_11_0.A v65.53,53.57 v65.53,53.56 | LED_11_1.A v69.53,53.57 v69.53,53.56 | LED_11_2.A v73.53,53.57 v73.53,53.56 | LED_11_3.A v77.54,53.57 v77.53,53.56 | LED_11_4.A v81.54,53.57 v81.53,53.56 | LED_11_5.A v85.54,53.57 v85.53,53.56 | LED_11_6.A v89.54,53.57 v89.53,53.56 | LED_11_7.A v93.54,53.57 v93.53,53.56 | LED_27_0.A v97.54,53.57 v97.53,53.56 | LED_27_1.A v101.54,53.57 v101.53,53.56 | LED_27_2.A v105.54,53.57 v105.53,53.56 | LED_27_3.A v109.54,53.57 v109.53,53.56 | LED_27_4.A v113.54,53.57 v113.53,53.56 | LED_27_5.A v117.54,53.57 v117.53,53.56 | LED_27_6.A v121.54,53.57 v121.53,53.56 | LED_27_7.A v125.54,53.57 v125.53,53.56 | LED_12_0.A v65.53,57.57 v65.53,57.56 | LED_12_1.A v69.53,57.57 v69.53,57.56 | LED_12_2.A v73.53,57.57 v73.53,57.56 | LED_12_3.A v77.54,57.57 v77.53,57.56 | LED_12_4.A v81.54,57.57 v81.53,57.56 | LED_12_5.A v85.54,57.57 v85.53,57.56 | LED_12_6.A v89.54,57.57 v89.53,57.56 | LED_12_7.A v93.54,57.57 v93.53,57.56 | LED_28_0.A v97.54,57.57 v97.53,57.56 | LED_28_1.A v101.54,57.57 v101.53,57.56 | LED_28_2.A v105.54,57.57 v105.53,57.56 | LED_28_3.A v109.54,57.57 v109.53,57.56 | LED_28_4.A v113.54,57.57 v113.53,57.56 | LED_28_5.A v117.54,57.57 v117.53,57.56 | LED_28_6.A v121.54,57.57 v121.53,57.56 | LED_28_7.A v125.54,57.57 v125.53,57.56 | LED_13_0.A v65.53,61.57 v65.53,61.56 | LED_13_1.A v69.53,61.57 v69.53,61.56
  Top 0.152: LED_13_2.A v73.53,61.57 v73.53,61.56 | LED_13_3.A v77.54,61.57 v77.53,61.56 | LED_13_4.A v81.54,61.57 v81.53,61.56 | LED_13_5.A v85.54,61.57 v85.53,61.56 | LED_13_6.A v89.54,61.57 v89.53,61.56 | LED_13_7.A v93.54,61.57 v93.53,61.56 | LED_29_0.A v97.54,61.57 v97.53,61.56 | LED_29_1.A v101.54,61.57 v101.53,61.56 | LED_29_2.A v105.54,61.57 v105.53,61.56 | LED_29_3.A v109.54,61.57 v109.53,61.56 | LED_29_4.A v113.54,61.57 v113.53,61.56 | LED_29_5.A v117.54,61.57 v117.53,61.56 | LED_29_6.A v121.54,61.57 v121.53,61.56 | LED_29_7.A v125.54,61.57 v125.53,61.56 | LED_14_0.A v65.53,65.57 v65.53,65.56 | LED_14_1.A v69.53,65.57 v69.53,65.56 | LED_14_2.A v73.53,65.57 v73.53,65.56 | LED_14_3.A v77.54,65.57 v77.53,65.56 | LED_14_4.A v81.54,65.57 v81.53,65.56 | LED_14_5.A v85.54,65.57 v85.53,65.56 | LED_14_6.A v89.54,65.57 v89.53,65.56 | LED_14_7.A v93.54,65.57 v93.53,65.56 | LED_30_0.A v97.54,65.57 v97.53,65.56 | LED_30_1.A v101.54,65.57 v101.53,65.56 | LED_30_2.A v105.54,65.57 v105.53,65.56 | LED_30_3.A v109.54,65.57 v109.53,65.56 | LED_30_4.A v113.54,65.57 v113.53,65.56 | LED_30_5.A v117.54,65.57 v117.53,65.56 | LED_30_6.A v121.54,65.57 v121.53,65.56 | LED_30_7.A v125.54,65.57 v125.53,65.56 | LED_15_0.A v65.53,69.57 v65.53,69.56 | LED_15_1.A v69.53,69.57 v69.53,69.56 | LED_15_2.A v73.53,69.57 v73.53,69.56 | LED_15_3.A v77.54,69.57 v77.53,69.56 | LED_15_4.A v81.54,69.57 v81.53,69.56 | LED_15_5.A v85.54,69.57 v85.53,69.56 | LED_15_6.A v89.54,69.57 v89.53,69.56 | LED_15_7.A v93.54,69.57 v93.53,69.56 | v97.53,69.56 v97.54,69.57 LED_31_0.A 98.65,69.46 98.65,65.65 LED_30_0.A | LED_31_1.A v101.54,69.57 v101.53,69.56
  Top 0.152: LED_31_2.A v105.54,69.57 v105.53,69.56 | LED_31_3.A v109.54,69.57 v109.53,69.56 | LED_31_4.A v113.54,69.57 v113.53,69.56 | LED_31_5.A v117.54,69.57 v117.53,69.56 | LED_31_6.A v121.54,69.57 v121.53,69.56 | LED_31_7.A v125.54,69.57 v125.53,69.56 | LED_24_0.A 98.65,41.52 98.63,41.54 LED_25_0.A | LED_25_0.A 98.65,45.65 98.65,49.46 LED_26_0.A | LED_26_0.A 98.65,49.62 98.65,53.43 LED_27_0.A | LED_27_0.A 98.65,53.59 98.65,57.56 LED_28_0.A | LED_28_0.A 98.65,57.72 98.65,61.53 LED_29_0.A | LED_29_0.A 98.65,61.68 98.65,65.49 LED_30_0.A | LED_21_0.A 98.65,29.62 98.65,33.43 LED_22_0.A | 47.69,16.44 47.69,9.61 47.21,9.14 SHIFT_1.8 | 47.69,16.44 47.21,16.92 SHIFT_3.8 | 47.69,16.44 47.69,22.31 | 47.69,22.31 47.69,24.54 47.21,25.01 SHIFT_5.8 | SHIFT_15.8 47.05,65.02 46.74,64.7 46.74,63.59 46.58,63.43 46.58,61.68 47.05,61.21 47.05,57.08 SHIFT_13.8 47.21,56.92 47.69,56.45 47.69,49.62 47.21,49.14 SHIFT_11.8 47.05,48.98 47.05,47.87 46.58,47.4 46.58,46.13 46.26,45.81 46.26,43.27 46.74,42.79 46.74,41.52 47.05,41.21 SHIFT_9.8 47.05,41.05 47.05,40.41 46.58,39.94 46.58,37.87 46.74,37.71 46.74,33.43 47.05,33.11 SHIFT_7.8 47.05,32.95 47.05,32.47 46.58,32 46.58,29.93 48.96,27.55 48.96,22.79 | 47.69,22.31 48.96,22.31 48.96,22.79 | v53.24,22.79 48.96,22.79 | LED_18_0.A 98.65,17.71 98.65,21.52 LED_19_0.A | LED_20_0.A 98.65,25.49 98.65,21.68 LED_19_0.A | LED_21_0.A 98.65,29.46 98.65,25.65 LED_20_0.A | 98.81,45.33 98.58,45.56 | LED_22_0.A 98.65,33.59 98.63,33.6 LED_23_0.A | 154.21,52.32 154.21,45.81 153.58,45.17 SHIFT_26.8 153.42,45.02 153.26,44.86 153.26,43.75 152.94,43.43 152.94,36.44
  Top 0.152: 154.21,52.32 153.58,52.95 SHIFT_28.8 | 154.21,52.32 154.21,60.41 153.58,61.05 SHIFT_30.8 | 153.26,9.46 153.26,9.61 152.94,9.93 152.94,12 153.42,12.47 153.42,12.95 SHIFT_18.8 153.42,13.11 153.42,13.74 152.94,14.22 152.94,20.57 153.42,21.04 SHIFT_20.8 153.58,21.2 153.58,25.17 152.94,25.81 152.94,28.51 153.42,28.98 SHIFT_22.8 153.58,29.14 153.58,33.27 152.94,33.9 152.94,36.44 | 153.26,9.46 153.26,7.23 | 153.26,7.23 153.26,5.33 153.42,5.17 SHIFT_16.8 | 152.94,36.44 153.42,36.92 SHIFT_24.8 | 176.91,16.44 176.91,9.61 176.44,9.14 SHIFT_17.8 | 176.75,16.6 176.44,16.92 SHIFT_19.8 | 176.75,16.6 176.91,16.44 | 176.91,24.54 176.44,25.01 SHIFT_21.8 | 176.91,16.44 176.91,24.54 | 176.91,32.47 176.44,32.95 SHIFT_23.8 | 176.91,24.54 176.91,32.47 | 176.91,40.57 176.44,41.05 SHIFT_25.8 | 176.91,32.47 176.91,40.57 | 176.91,48.51 176.44,48.98 SHIFT_27.8 | 176.91,40.57 176.91,48.51 | 176.91,56.45 176.44,56.92 SHIFT_29.8 | 176.91,48.51 176.91,56.45 | 176.91,56.45 176.91,64.54 176.44,65.02 SHIFT_31.8 | 153.26,7.23 173.58,7.23 174.37,8.02 174.37,12.63 175.8,14.06 175.8,15.65 176.75,16.6 | SHIFT_2.8 24.19,12.95 23.72,12.47 23.72,5.65 24.19,5.17 SHIFT_0.8 24.35,5.17 v30.38,5.17 | SHIFT_2.8 24.35,13.11 24.35,14.54 23.72,15.17 23.72,20.57 24.19,21.04 SHIFT_4.8 24.35,21.2 24.35,22.63 23.72,23.27 23.72,28.51 24.19,28.98 SHIFT_6.8 24.35,29.14 24.35,30.41 23.72,31.05 23.72,36.44 24.19,36.92 SHIFT_8.8 24.35,38.51 23.72,39.14 23.72,44.54 24.19,45.02 SHIFT_10.8 24.35,45.17 24.35,46.44 23.72,47.08 23.72,52.48 24.19,52.95 SHIFT_12.8 24.35,53.11 24.35,54.54 23.72,55.18 23.72,60.57 24.19,61.05 SHIFT_14.8
  Top 0.152: v153.58,9.46 153.26,9.46 | LED_18_0.A 98.65,17.55 98.65,13.58 LED_17_0.A | LED_24_0.A LED_23_0.A | SHIFT_2.8 25.3,12.12 v25.3,11.89 | v97.53,45.56 LED_25_0.A
  Bottom 0.152: v65.53,13.56 v69.53,13.56 v73.53,13.56 v77.53,13.56 v81.53,13.56 v85.53,13.56 v89.53,13.56 v93.53,13.56 v97.53,13.56 v101.53,13.56 v105.53,13.56 v109.53,13.56 v113.53,13.56 v117.53,13.56 v121.53,13.56 v125.53,13.56 | v65.53,17.56 v69.53,17.56 v73.53,17.56 v77.53,17.56 v81.53,17.56 v85.53,17.56 v89.53,17.56 v93.53,17.56 v97.53,17.56 v101.53,17.56 v105.53,17.56 v109.53,17.56 v113.53,17.56 v117.53,17.56 v121.53,17.56 v125.53,17.56 | v125.53,21.56 v121.53,21.56 v117.53,21.56 v113.53,21.56 v109.53,21.56 v105.53,21.56 v101.53,21.56 v97.53,21.56 v93.53,21.56 v89.53,21.56 v85.53,21.56 v81.53,21.56 v77.53,21.56 v73.53,21.56 v69.53,21.56 v65.53,21.56 65.47,21.68 54.36,21.68 v53.24,22.79 | v65.53,25.56 v69.53,25.56 v73.53,25.56 v77.53,25.56 v81.53,25.56 v85.53,25.56 v89.53,25.56 v93.53,25.56 v97.53,25.56 v101.53,25.56 v105.53,25.56 v109.53,25.56 v113.53,25.56 v117.53,25.56 v121.53,25.56 v125.53,25.56 | v65.53,29.56 v69.53,29.56 v73.53,29.56 v77.53,29.56 v81.53,29.56 v85.53,29.56 v89.53,29.56 v93.53,29.56 v97.53,29.56 v101.53,29.56 v105.53,29.56 v109.53,29.56 v113.53,29.56 v117.53,29.56 v121.53,29.56 v125.53,29.56 | v65.53,33.56 v69.53,33.56 v73.53,33.56 v77.53,33.56 v81.53,33.56 v85.53,33.56 v89.53,33.56 v93.53,33.56 v97.53,33.56 v101.53,33.56 v105.53,33.56 v109.53,33.56 v113.53,33.56 v117.53,33.56 v121.53,33.56 v125.53,33.56 | v65.53,37.56 v69.53,37.56 v73.53,37.56 v77.53,37.56 v81.53,37.56 v85.53,37.56 v89.53,37.56 v93.53,37.56 v97.53,37.56 v101.53,37.56 v105.53,37.56 v109.53,37.56 v113.53,37.56 v117.53,37.56 v121.53,37.56 v125.53,37.56
  Bottom 0.152: v65.53,41.56 v69.53,41.56 v73.53,41.56 v77.53,41.56 v81.53,41.56 v85.53,41.56 v89.53,41.56 v93.53,41.56 v97.53,41.56 v101.53,41.56 v105.53,41.56 v109.53,41.56 v113.53,41.56 v117.53,41.56 v121.53,41.56 v125.53,41.56 | v65.53,45.56 v69.53,45.56 v73.53,45.56 v77.53,45.56 v81.53,45.56 v85.53,45.56 v89.53,45.56 v93.53,45.56 v97.53,45.56 v101.53,45.56 v105.53,45.56 v109.53,45.56 v113.53,45.56 v117.53,45.56 v121.53,45.56 v125.53,45.56 | v65.53,49.56 v69.53,49.56 v73.53,49.56 v77.53,49.56 v81.53,49.56 v85.53,49.56 v89.53,49.56 v93.53,49.56 v97.53,49.56 v101.53,49.56 v105.53,49.56 v109.53,49.56 v113.53,49.56 v117.53,49.56 v121.53,49.56 v125.53,49.56 | v65.53,53.56 v69.53,53.56 v73.53,53.56 v77.53,53.56 v81.53,53.56 v85.53,53.56 v89.53,53.56 v93.53,53.56 v97.53,53.56 v101.53,53.56 v105.53,53.56 v109.53,53.56 v113.53,53.56 v117.53,53.56 v121.53,53.56 v125.53,53.56 | v65.53,57.56 v69.53,57.56 v73.53,57.56 v77.53,57.56 v81.53,57.56 v85.53,57.56 v89.53,57.56 v93.53,57.56 v97.53,57.56 v101.53,57.56 v105.53,57.56 v109.53,57.56 v113.53,57.56 v117.53,57.56 v121.53,57.56 v125.53,57.56 | v65.53,61.56 v69.53,61.56 v73.53,61.56 v77.53,61.56 v81.53,61.56 v85.53,61.56 v89.53,61.56 v93.53,61.56 v97.53,61.56 v101.53,61.56 v105.53,61.56 v109.53,61.56 v113.53,61.56 v117.53,61.56 v121.53,61.56 v125.53,61.56 | v65.53,65.56 v69.53,65.56 v73.53,65.56 v77.53,65.56 v81.53,65.56 v85.53,65.56 v89.53,65.56 v93.53,65.56 v97.53,65.56 v101.53,65.56 v105.53,65.56 v109.53,65.56 v113.53,65.56 v117.53,65.56 v121.53,65.56 v125.53,65.56 | v65.53,69.56 v69.53,69.56 v73.53,69.56 v77.53,69.56 v81.53,69.56 v85.53,69.56 v89.53,69.56 v93.53,69.56 v97.53,69.56 v101.53,69.56 v105.53,69.56 v109.53,69.56 v113.53,69.56 v117.53,69.56 v121.53,69.56 v125.53,69.56
  Bottom 0.152: v30.38,5.17 31.18,5.96 61.98,5.96 65.47,9.46 v65.53,9.56 v69.53,9.56 v73.53,9.56 v77.53,9.56 v81.53,9.56 v85.53,9.56 v89.53,9.56 v93.53,9.56 v97.53,9.56 v101.53,9.56 v105.53,9.56 v109.53,9.56 v113.53,9.56 v117.53,9.56 v121.53,9.56 v125.53,9.56 129.44,9.56 129.44,9.61 130.24,10.41 152.62,10.41 v153.58,9.46 | v25.3,11.89 25.3,13.26 13.56,13.26 12.65,14.17 12.65,22.25 | 12.65,22.25 J3.4 | C1.- 12.59,36.03 | 12.59,36.03 12.65,36.03 | 12.65,36.03 12.65,35.97 | 12.65,35.97 12.65,22.25 | J2.2 12.6,45.06 12.65,45.11 | J1.6 11.68,62.99 12.65,62.03 12.65,45.11 | 12.65,45.11 12.65,36.03 | 12.59,36.03 12.65,35.97
OE  (via drill 0.35)
  Top 0.152: 149.13,15.81 149.13,16.28 148.5,16.92 148.5,18.66 SHIFT_18.13 148.34,18.82 147.86,19.3 147.86,24.06 148.5,24.7 148.5,26.6 SHIFT_20.13 148.34,26.76 147.86,27.24 147.86,31.52 148.5,32.16 148.5,34.54 SHIFT_22.13 148.34,34.7 147.86,35.17 147.86,38.82 148.5,39.46 148.5,42.63 SHIFT_24.13 148.34,42.79 147.86,43.27 147.86,50.1 148.34,50.57 SHIFT_26.13 148.5,50.73 149.13,51.37 149.13,56.13 148.5,56.76 148.5,58.51 SHIFT_28.13 148.34,58.67 147.86,59.14 147.86,63.43 148.5,64.07 148.5,66.61 SHIFT_30.13 148.34,66.76 147.22,67.88 v147.22,71.21 | 149.13,15.81 149.13,11.36 148.5,10.73 SHIFT_16.13 | SHIFT_31.13 171.2,70.57 170.88,70.26 170.88,65.97 170.72,65.81 170.72,63.27 171.2,62.8 SHIFT_29.13 171.2,62.64 171.2,58.99 170.72,58.51 170.72,55.18 171.2,54.7 SHIFT_27.13 171.2,54.54 171.2,50.25 170.72,49.78 170.72,46.13 | 170.88,15.81 170.88,16.12 170.72,16.28 170.72,22.16 171.2,22.63 SHIFT_19.13 171.2,22.79 170.72,23.27 170.72,26.76 171.2,27.24 171.2,30.57 SHIFT_21.13 171.2,30.73 170.72,31.2 170.72,34.7 171.2,35.17 171.2,38.67 SHIFT_23.13 171.2,38.82 170.72,39.3 170.72,46.13 | 170.88,15.81 170.88,15.01 171.2,14.69 SHIFT_17.13 | 170.72,46.13 171.2,46.6 SHIFT_25.13 | v148.81,15.81 149.13,15.81 | 170.88,15.81 v171.2,15.81 | 18.64,11.89 18.64,13.74 19.27,14.38 SHIFT_2.13 19.11,18.82 18.64,19.3 18.64,21.68 19.11,22.16 19.11,26.6 SHIFT_4.13 19.11,26.76 18.64,27.24 18.64,29.78 19.27,30.41 19.27,34.54 SHIFT_6.13 19.11,34.7 18.64,35.17 v18.64,38.19 18.64,43.27 | 18.64,11.89 18.64,11.2 19.11,10.73 SHIFT_0.13 | 18.64,43.27 19.11,42.79 SHIFT_8.13
  Top 0.152: 18.64,43.27 18.64,45.97 19.27,46.6 19.27,50.57 SHIFT_10.13 19.11,50.73 18.64,51.21 18.64,53.75 19.11,54.22 19.11,58.51 SHIFT_12.13 19.11,58.67 18.64,59.14 18.64,61.84 19.27,62.48 19.27,66.61 SHIFT_14.13 | SHIFT_1.13 42.13,14.69 42.61,15.17 42.61,19.3 42.13,19.77 42.13,22.63 SHIFT_3.13 42.13,22.79 42.61,23.27 42.61,30.09 42.13,30.57 SHIFT_5.13 42.61,31.2 42.61,36.13 | 42.61,36.13 42.61,36.28 42.13,36.76 42.13,38.67 SHIFT_7.13 42.13,38.82 42.61,39.3 42.61,43.9 42.13,44.38 42.13,46.6 SHIFT_9.13 42.13,46.76 42.61,47.24 42.61,52 42.13,52.48 42.13,54.54 SHIFT_11.13 42.13,54.7 42.61,55.18 42.61,59.3 42.13,59.78 42.13,62.64 SHIFT_13.13 42.13,62.8 42.61,63.27 42.61,68.19 42.13,68.67 42.13,70.57 SHIFT_15.13 42.13,70.73 42.13,71.84 v42.77,72.48 | 42.61,36.13 v42.45,36.13 | 18.64,11.89 v16.2,11.89 | v13.56,11.89 11.74,11.89 10.52,13.11 10.52,16.46 9.8,17.17 J3.2 7.62,17.17 6.1,18.69 v6.1,24.54 | J1.2 6.96,52.83 6.25,52.12 6.25,26.67 8.08,24.84 v8.08,24.54
  Bottom 0.152: v171.2,15.81 v148.81,15.81 | v18.64,38.19 20.7,36.13 v42.45,36.13 | v147.22,71.21 145.96,72.48 v42.77,72.48 | v16.2,11.89 v13.56,11.89 | v8.08,24.54 v6.1,24.54
Q0_0  (via drill 0.35)
  Top 0.152: LED_0_0.C 67.65,8.84 64.01,8.84 v61.72,11.13 | v33.53,11.13 33.49,11.13 4R_0_0.8 32.45,10.25 31.34,10.25 4R_0_0.1 | v17.37,9.61 16.73,10.25 16.73,10.57 SHIFT_0.15
  Bottom 0.152: v61.72,11.13 v33.53,11.13 33.4,11.04 31.97,9.61 v17.37,9.61
Q0_1  (via drill 0.35)
  Top 0.152: LED_0_1.C 72.38,9.48 71.44,8.53 63.46,8.53 v62.28,9.71 | v34.29,10.52 33.83,10.52 32.68,9.37 4R_0_0.7 32.45,9.46 31.34,9.46 4R_0_0.2 | v19.11,8.82 15.46,5.17 SHIFT_0.1
  Bottom 0.152: v62.28,9.71 61.17,10.82 34.59,10.82 v34.29,10.52 34.2,10.41 32.61,8.82 v19.11,8.82
Q0_2  (via drill 0.35)
  Top 0.152: LED_0_2.C 75.05,8.23 62.9,8.23 v62.33,8.8 | v35.2,10.21 34.9,9.91 34.17,9.91 32.84,8.57 4R_0_0.6 32.45,8.66 31.34,8.66 4R_0_0.3 | v19.43,7.87 16.73,5.17 SHIFT_0.2
  Bottom 0.152: v62.33,8.8 60.61,10.52 35.51,10.52 v35.2,10.21 35.15,10.09 32.92,7.87 v19.43,7.87
Q0_3  (via drill 0.35)
  Top 0.152: LED_0_3.C 78.73,7.92 62.35,7.92 v61.35,8.92 61.34,8.98 60.55,9.77 57.84,9.77 51.49,3.42 18.54,3.42 18,3.96 18,5.01 SHIFT_0.3 | v36.09,9.81 35.79,9.51 34.42,9.51 32.68,7.77 4R_0_0.5 32.45,7.87 31.34,7.87 4R_0_0.4
  Bottom 0.152: v61.35,8.92 60.06,10.21 37.25,10.21 36.85,9.81 v36.09,9.81
Q0_4  (via drill 0.35)
  Top 0.152: LED_0_4.C 82.43,7.61 61.8,7.61 v60.31,9.1 | v34.67,8.75 32.68,6.77 4R_0_1.8 32.45,6.76 31.34,6.76 4R_0_1.1 | v21.34,7.23 19.27,5.17 SHIFT_0.4
  Bottom 0.152: v60.31,9.1 60.31,9.49 59.89,9.91 37.38,9.91 36.68,9.2 35.12,9.2 v34.67,8.75 34.51,8.66 33.08,7.23 v21.34,7.23
Q0_5  (via drill 0.35)
  Top 0.152: LED_0_5.C 86.13,7.31 61.24,7.31 v60.41,8.14 | v35.58,8.6 35.42,8.6 32.79,5.97 4R_0_1.7 32.45,5.96 31.34,5.96 4R_0_1.2 | v21.65,6.28 20.54,5.17 SHIFT_0.5
  Bottom 0.152: v60.41,8.14 59.7,8.85 59.7,9.49 59.59,9.6 37.5,9.6 36.5,8.6 v35.58,8.6 35.47,8.5 35.31,8.34 35.15,8.34 33.08,6.28 v21.65,6.28
Q0_6  (via drill 0.35)
  Top 0.152: LED_0_6.C 89.79,6.97 60.72,6.97 59.81,7.89 59.81,8.28 v59.1,8.99 | 4R_0_1.3 31.34,5.17 32.45,5.17 4R_0_1.6 32.85,5.17 v35.37,7.69 35.47,7.71 35.78,7.71 36.42,8.34 37.69,8.34 37.69,8.03 37.85,7.87 37.85,7.39 34.2,3.74 22.19,3.74 21.81,4.11 21.81,5.01 SHIFT_0.6
  Bottom 0.152: v59.1,8.99 59.1,9.03 58.83,9.3 37.95,9.3 36.34,7.69 v35.37,7.69
Q0_7  (via drill 0.35)
  Top 0.152: LED_0_7.C 93.48,6.67 60.39,6.67 59.2,7.86 v59.2,8.03 | v37.16,7.65 36.19,7.65 32.91,4.37 4R_0_1.5 32.45,4.38 31.34,4.38 4R_0_1.4 31.18,4.22 23.08,4.22 23.08,5.01 SHIFT_0.7
  Bottom 0.152: v59.2,8.03 58.49,8.74 58.49,8.99 38.5,8.99 v37.16,7.65
Q1_0  (via drill 0.35)
  Top 0.152: LED_1_0.C 67.62,12.8 64.31,12.8 62.94,14.17 55.34,14.17 4R_1_0.8 55.31,14.22 54.2,14.22 4R_1_0.1 54.04,14.06 v48.96,14.06 | v39.59,13.42 39.59,14.54 SHIFT_1.15
  Bottom 0.152: v48.96,14.06 48.64,13.74 39.91,13.74 v39.59,13.42
Q1_1  (via drill 0.35)
  Top 0.152: LED_1_1.C 71.31,12.5 64.16,12.5 62.79,13.87 56.14,13.87 55.64,13.37 4R_1_0.7 55.31,13.42 54.2,13.42 4R_1_0.2 54.04,13.27 48.64,13.27 v48.64,8.34 | v39.43,7.87 38.32,8.98 SHIFT_1.1
  Bottom 0.152: v48.64,8.34 39.91,8.34 v39.43,7.87
Q1_2  (via drill 0.35)
  Top 0.152: LED_1_2.C 75.01,12.19 64.03,12.19 62.66,13.56 56.43,13.56 55.43,12.57 4R_1_0.6 55.31,12.63 54.2,12.63 4R_1_0.3 54.04,12.47 49.59,12.47 v49.59,8.34 | v40.86,7.71 39.59,8.98 SHIFT_1.2
  Bottom 0.152: v49.59,8.34 48.96,7.71 v40.86,7.71
Q1_3  (via drill 0.35)
  Top 0.152: LED_1_3.C 78.81,11.99 | 78.81,11.99 78.7,11.89 63.91,11.89 62.54,13.26 56.92,13.26 55.43,11.77 4R_1_0.5 55.31,11.84 54.2,11.84 4R_1_0.4 | v78.33,12.47 78.81,11.99 | v44.51,12.79 40.86,9.14 SHIFT_1.3
  Bottom 0.152: v78.33,12.47 78.01,12.79 v44.51,12.79
Q1_4  (via drill 0.35)
  Top 0.152: LED_1_4.C 82.4,11.58 63.78,11.58 62.41,12.95 57.57,12.95 55.38,10.77 4R_1_1.8 55.31,10.88 54.2,10.88 4R_1_1.1 54.04,10.88 v53.09,11.84 | v44.83,11.84 42.13,9.14 SHIFT_1.4
  Bottom 0.152: v53.09,11.84 52.45,12.47 45.47,12.47 v44.83,11.84
Q1_5  (via drill 0.35)
  Top 0.152: LED_1_5.C 86.09,11.28 63.66,11.28 62.28,12.65 58.11,12.65 55.43,9.97 4R_1_1.7 55.31,10.09 54.2,10.09 4R_1_1.2 54.04,10.09 50.55,10.09 v50.55,11.84 | v45.78,11.84 43.4,9.46 43.4,9.14 SHIFT_1.5
  Bottom 0.152: v45.78,11.84 v50.55,11.84
Q1_6  (via drill 0.35)
  Top 0.152: LED_1_6.C 89.79,10.97 63.53,10.97 62.16,12.34 58.64,12.34 55.46,9.17 4R_1_1.6 55.31,9.3 54.2,9.3 4R_1_1.3 54.04,9.14 50.86,9.14 v50.86,8.34 | v46.1,7.07 44.67,8.5 44.67,8.98 SHIFT_1.6
  Bottom 0.152: v50.86,8.34 49.59,7.07 v46.1,7.07
Q1_7
  Top 0.152: LED_1_7.C 96.38,13.48 93.58,10.67 63.4,10.67 62.03,12.04 59.16,12.04 55.48,8.37 4R_1_1.5 55.31,8.5 54.2,8.5 4R_1_1.4 54.04,8.34 53.4,7.71 45.94,7.71 45.94,8.98 SHIFT_1.7
Q2_0  (via drill 0.35)
  Top 0.152: LED_2_0.C 67.65,16.84 64.01,16.84 v61.72,19.13 | v33.53,19.13 33.49,19.13 4R_2_0.8 32.45,18.19 31.34,18.19 4R_2_0.1 | v17.37,19.77 16.73,19.14 16.73,18.82 SHIFT_2.15
  Bottom 0.152: v61.72,19.13 v33.53,19.13 33.4,19.14 32.77,19.77 v17.37,19.77
Q2_1  (via drill 0.35)
  Top 0.152: LED_2_1.C 72.32,17.57 71.29,16.53 63.46,16.53 v62.28,17.71 | v34.29,18.52 33.83,18.52 32.68,17.37 4R_2_0.7 32.45,17.39 31.34,17.39 4R_2_0.2 | v15.46,14.38 15.46,13.11 SHIFT_2.1
  Bottom 0.152: v62.28,17.71 61.17,18.82 34.59,18.82 v34.29,18.52 34.2,18.5 33.88,18.19 19.27,18.19 v15.46,14.38
Q2_2  (via drill 0.35)
  Top 0.152: LED_2_2.C 75.05,16.23 62.9,16.23 v62.33,16.8 | v35.2,18.21 34.9,17.91 34.17,17.91 32.84,16.57 4R_2_0.6 32.45,16.6 31.34,16.6 4R_2_0.3 | v16.73,14.69 16.73,13.11 SHIFT_2.2
  Bottom 0.152: v62.33,16.8 60.61,18.52 35.51,18.52 v35.2,18.21 35.15,18.19 34.83,17.87 19.91,17.87 v16.73,14.69
Q2_3  (via drill 0.35)
  Top 0.152: LED_2_3.C 78.73,15.92 62.35,15.92 v61.35,16.92 | v36.09,17.81 35.79,17.51 34.42,17.51 32.68,15.77 4R_2_0.5 32.45,15.81 31.34,15.81 4R_2_0.4 | v17.69,14.69 17.84,14.54 17.84,13.11 SHIFT_2.3
  Bottom 0.152: v61.35,16.92 60.06,18.21 37.25,18.21 36.85,17.81 v36.09,17.81 35.94,17.71 35.78,17.55 20.54,17.55 v17.69,14.69
Q2_4  (via drill 0.35)
  Top 0.152: LED_2_4.C 82.43,15.61 61.8,15.61 v60.31,17.1 | v34.67,16.75 32.68,14.77 4R_2_1.8 32.45,14.85 31.34,14.85 4R_2_1.1 31.18,14.85 v25.3,14.85 | v19.91,14.85 19.59,14.54 19.59,13.42 19.27,13.11 SHIFT_2.4
  Bottom 0.152: v60.31,17.1 60.31,17.49 59.89,17.91 37.38,17.91 36.68,17.2 35.12,17.2 v34.67,16.75 | v19.91,14.85 v25.3,14.85
Q2_5  (via drill 0.35)
  Top 0.152: LED_2_5.C 86.13,15.31 61.24,15.31 v60.41,16.14 | v35.58,16.6 35.42,16.6 32.79,13.97 4R_2_1.7 32.45,14.06 31.34,14.06 4R_2_1.2 31.18,14.06 24.67,14.06 v24.67,16.12 | v21.18,16.28 20.86,15.96 20.86,13.42 20.54,13.11 SHIFT_2.5
  Bottom 0.152: v60.41,16.14 59.7,16.85 59.7,17.49 59.59,17.6 37.5,17.6 36.5,16.6 v35.58,16.6 | v24.67,16.12 24.51,16.28 v21.18,16.28
Q2_6  (via drill 0.35)
  Top 0.152: LED_2_6.C 89.79,14.97 60.72,14.97 59.81,15.89 59.81,16.28 v59.1,16.99 | v35.37,15.69 32.85,13.17 4R_2_1.6 32.45,13.27 31.34,13.27 4R_2_1.3 | v22.29,15.49 21.81,15.01 21.81,13.11 SHIFT_2.6
  Bottom 0.152: v59.1,16.99 59.1,17.03 58.83,17.3 37.95,17.3 36.34,15.69 v35.37,15.69 35.31,15.65 35.15,15.49 v22.29,15.49
Q2_7  (via drill 0.35)
  Top 0.152: LED_2_7.C 93.48,14.67 60.39,14.67 59.2,15.86 v59.2,16.03 | v37.16,15.65 36.19,15.65 32.91,12.37 4R_2_1.5 32.45,12.47 31.34,12.47 4R_2_1.4 | v23.72,14.22 23.08,13.58 23.08,13.11 SHIFT_2.7
  Bottom 0.152: v59.2,16.03 58.49,16.74 58.49,16.99 38.5,16.99 v37.16,15.65 37.05,15.65 35.62,14.22 v23.72,14.22
Q3_0  (via drill 0.35)
  Top 0.152: LED_3_0.C 67.62,20.8 64.31,20.8 62.94,22.17 55.34,22.17 4R_3_0.8 55.31,22.16 54.2,22.16 4R_3_0.1 54.04,22.16 v51.02,22.16 | v39.59,21.52 39.59,22.63 SHIFT_3.15
  Bottom 0.152: v51.02,22.16 40.23,22.16 v39.59,21.52
Q3_1  (via drill 0.35)
  Top 0.152: LED_3_1.C 71.31,20.5 64.16,20.5 62.79,21.87 56.14,21.87 55.64,21.37 4R_3_0.7 55.31,21.36 54.2,21.36 4R_3_0.2 54.04,21.52 v50.23,21.52 | v38.16,20.89 38.16,17.08 SHIFT_3.1
  Bottom 0.152: v50.23,21.52 50.07,21.68 40.7,21.68 39.91,20.89 v38.16,20.89
Q3_2  (via drill 0.35)
  Top 0.152: LED_3_2.C 75.01,20.19 73.09,20.19 | 73.09,20.19 64.03,20.19 62.66,21.56 56.43,21.56 55.43,20.57 4R_3_0.6 55.31,20.57 54.2,20.57 4R_3_0.3 | v73.09,20.57 73.09,20.19 | v40.23,12.63 40.23,16.28 39.59,16.92 SHIFT_3.2
  Bottom 0.152: v73.09,20.57 70.71,18.19 64.67,18.19 59.91,13.42 41.02,13.42 v40.23,12.63
Q3_3  (via drill 0.35)
  Top 0.152: LED_3_3.C 78.7,19.89 63.91,19.89 62.54,21.26 56.92,21.26 55.43,19.77 4R_3_0.5 55.31,19.77 54.2,19.77 4R_3_0.4 54.04,19.77 51.66,19.77 51.66,20.09 51.34,20.41 48.32,20.41 v48.32,16.28 | v41.5,15.96 40.86,16.6 40.86,16.92 SHIFT_3.3
  Bottom 0.152: v48.32,16.28 48.16,16.44 41.97,16.44 v41.5,15.96
Q3_4  (via drill 0.35)